# EAGLE design avr_core_1_1 (EAGLE 5.07)
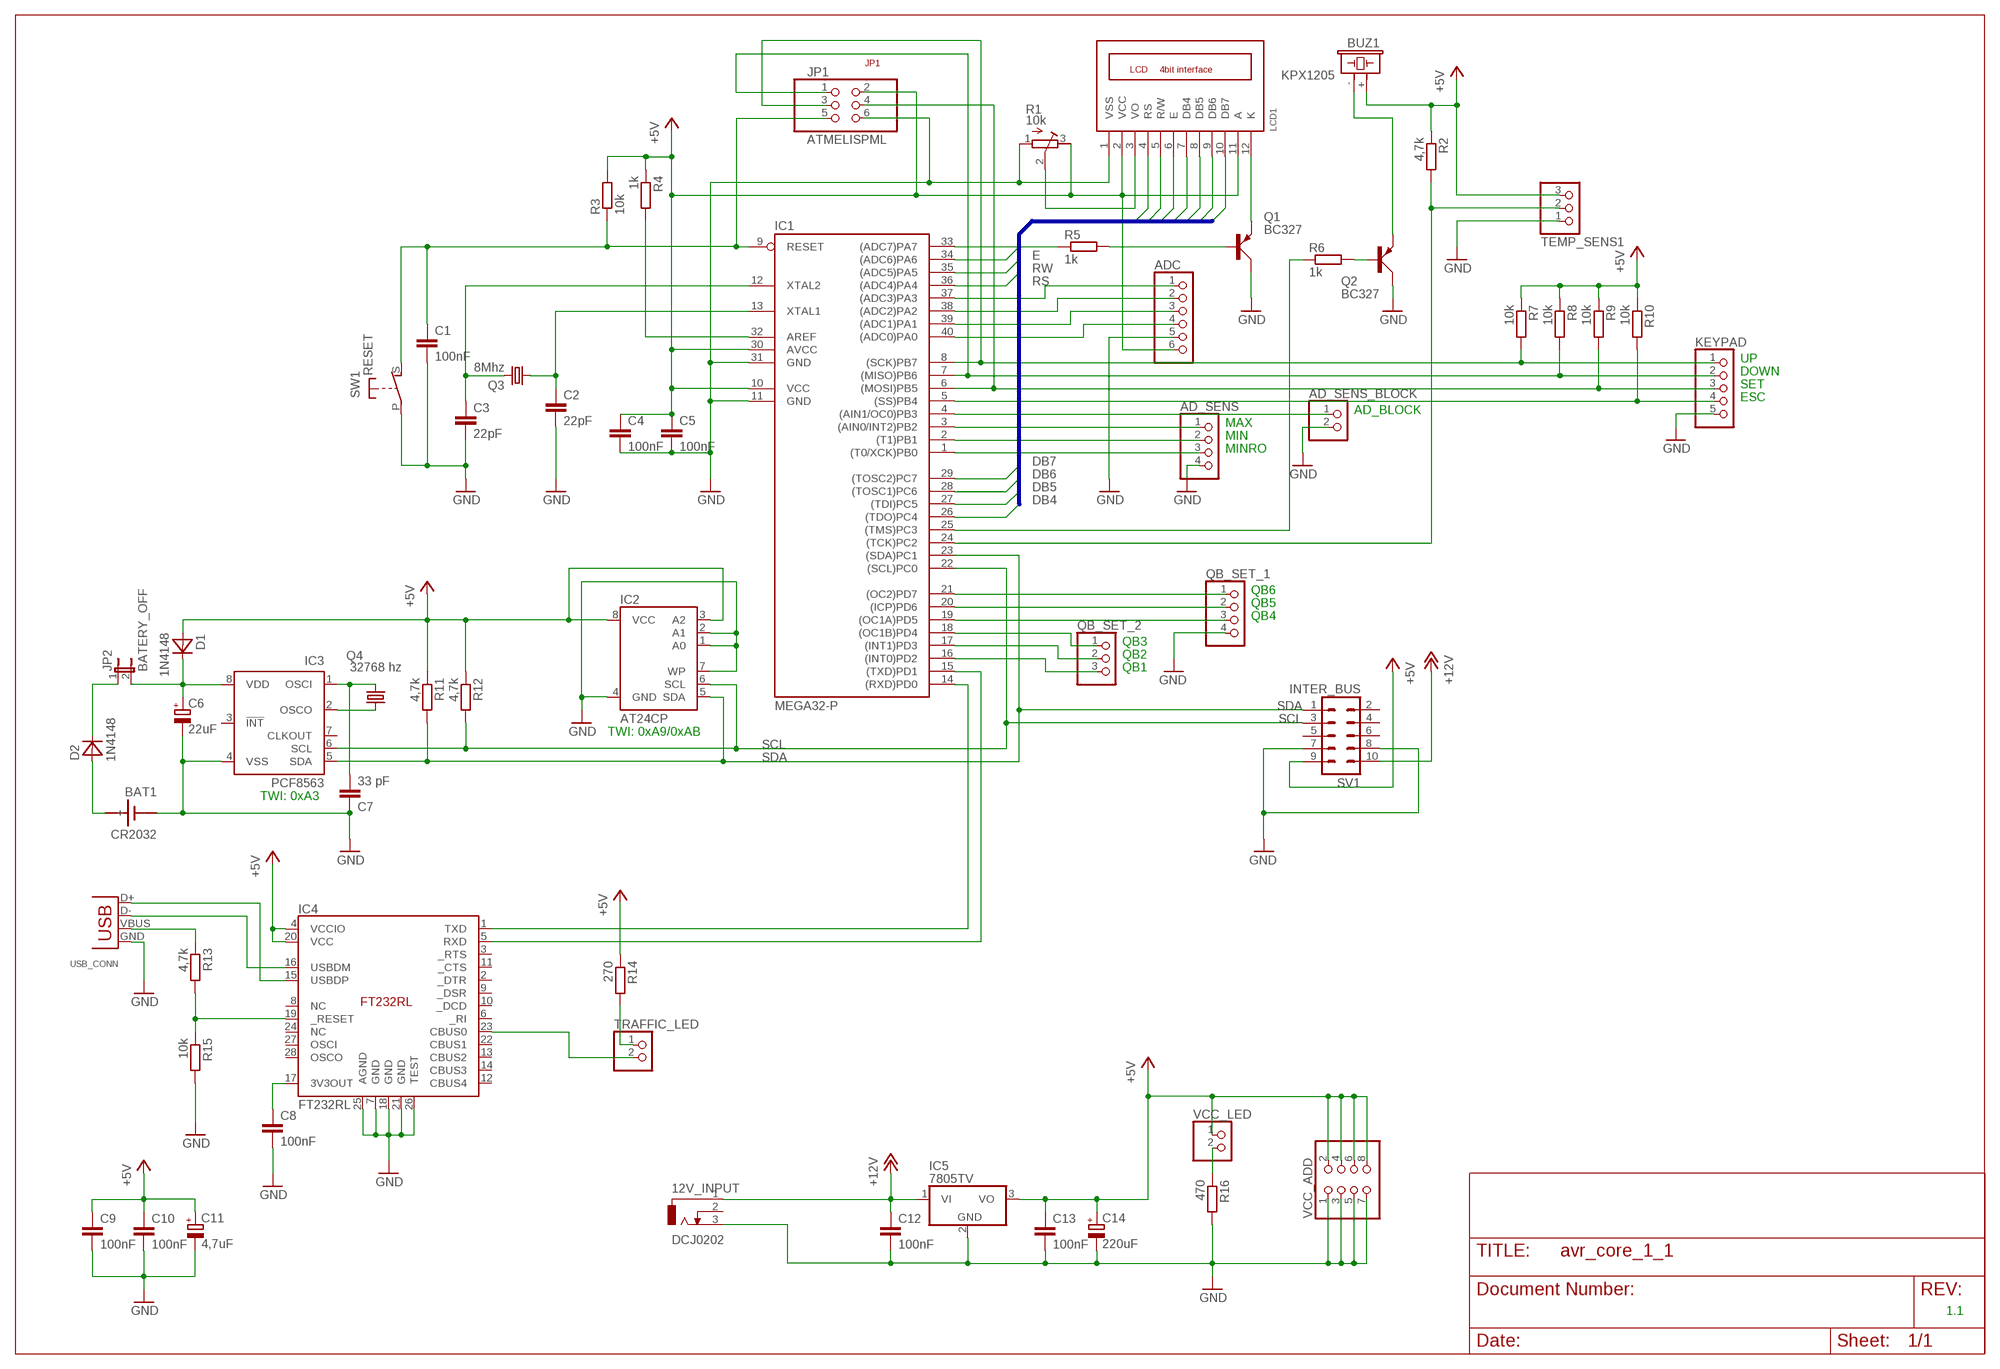
[diagram p0: schematic, sheet 1]

## Parts
12V_INPUT  DCJ0202  [DCJ0202]
AD_SENS  PINHD-1X4  [1X04]
AD_SENS_BLOCK  PINHD-1X2  [1X02]
ADC  PINHD-1X6  [1X06]
BAT1  CR2032  SN2032LISPOL  [SN2932_LISPOL]
BUZ1  KPX1205  [KPX1205]
C1  100nF  C-EU050-024X044  [C050-024X044]
C2  22pF  C-EU050-024X044  [C050-024X044]
C3  22pF  C-EU050-024X044  [C050-024X044]
C4  100nF  C-EUC1206  [C1206]
C5  100nF  C-EUC1206  [C1206]
C6  22uF  CPOL-EUE2.5-5  [E2,5-5]
C7  33 pF  C-EU050-024X044  [C050-024X044]
C8  100nF  C-EU050-024X044  [C050-024X044]
C9  100nF  C-EU050-024X044  [C050-024X044]
C10  100nF  C-EU050-024X044  [C050-024X044]
C11  4,7uF  CPOL-EUE2.5-5  [E2,5-5]
C12  100nF  C-EU050-024X044  [C050-024X044]
C13  100nF  C-EU050-024X044  [C050-024X044]
C14  220uF  CPOL-EUE2.5-5  [E2,5-5]
D1  1N4148  [DO35-7]
D2  1N4148  [DO35-7]
IC1  MEGA32-P  [DIL40]
IC2  AT24CP  [DIL08]
IC3  PCF8563  [DIL08]
IC4  FT232RL  [SSOP-28]
IC5  7805TV  [TO220V]
JP1  ATMELISPML  [ML6]
JP2  BATERY_OFF  JP1E  [JP1]
KEYPAD  PINHD-1X5  [1X05]
LCD1  LCD_4BITML14  [ML14]
Q1  BC327  [SOT54A]
Q2  BC327  [SOT54A]
Q3  8Mhz  CRYSTALHC49S  [HC49/S]
Q4  32768 hz  CRYSTALTC26V  [TC26V]
QB_SET_1  PINHD-1X4  [1X04]
QB_SET_2  PINHD-1X3  [1X03]
R1  10k  R-TRIMM  [R-TRIMM]
R2  4,7k  R-EU_0207/10  [0207/10]
R3  10k  R-EU_0207/10  [0207/10]
R4  1k  R-EU_0207/10  [0207/10]
R5  1k  R-EU_0207/10  [0207/10]
R6  1k  R-EU_0207/10  [0207/10]
R7  10k  R-EU_0207/10  [0207/10]
R8  10k  R-EU_0207/10  [0207/10]
R9  10k  R-EU_0207/10  [0207/10]
R10  10k  R-EU_0207/10  [0207/10]
R11  4,7k  R-EU_0207/10  [0207/10]
R12  4,7k  R-EU_0207/10  [0207/10]
R13  4,7k  R-EU_0207/10  [0207/10]
R14  270  R-EU_0207/10  [0207/10]
R15  10k  R-EU_0207/10  [0207/10]
R16  470  R-EU_0207/10  [0207/10]
SV1  INTER_BUS  ML10L  [ML10L]
SW1  RESET  [MICRO_SWITCH_3X6]
TEMP_SENS1  PINHD-1X3  [1X03]
TRAFFIC_LED  PINHD-1X2  [1X02]
USB_CONN  USB-B-H  [USB-B-H]
VCC_ADD  PINHD-2X4  [2X04]
VCC_LED  PINHD-1X2  [1X02]

## Nets
+5V [power]: ADC.6 BUZ1.+(PLUS) C4.1 C5.1 C9.1 C10.1 C11.+ C13.1 C14.+ D1.A IC1.10(VCC) IC1.30(AVCC) IC2.3(A2) IC2.8(VCC) IC4.4(VCCIO) IC4.20(VCC) IC5.3(VO) JP1.2(VCC) LCD1.2(VCC) LCD1.11(A) R1.3(A) R2.1 R3.2 R4.1 R7.1 R8.1 R9.1 R10.1 R11.1 R12.1 R14.1 SV1.9 TEMP_SENS1.3 VCC_ADD.2 VCC_ADD.4 VCC_ADD.6 VCC_ADD.8 VCC_LED.1
+12V: 12V_INPUT.1 C12.1 IC5.1(VI) SV1.10
DB4: IC1.26((TDO)PC4) LCD1.7(DB4)
DB5: IC1.27((TDI)PC5) LCD1.8(DB5)
DB6: IC1.28((TOSC1)PC6) LCD1.9(DB6)
DB7: IC1.29((TOSC2)PC7) LCD1.10(DB7)
E: IC1.34((ADC6)PA6) LCD1.6(E)
GND [power]: 12V_INPUT.3 AD_SENS.4 AD_SENS_BLOCK.2 ADC.5 BAT1.- C1.2 C2.2 C3.2 C4.2 C5.2 C6.- C7.1 C8.2 C9.2 C10.2 C11.- C12.2 C13.2 C14.- IC1.11(GND) IC1.31(GND) IC2.1(A0) IC2.2(A1) IC2.4(GND) IC2.7(WP) IC3.4(VSS) IC4.7(GND) IC4.18(GND) IC4.21(GND) IC4.25(AGND) IC4.26(TEST) IC5.2(GND) JP1.6(GND) KEYPAD.5 LCD1.1(VSS) Q1.C Q2.C QB_SET_1.4 R1.1(E) R15.2 R16.2 SV1.7 SV1.8 SW1.P TEMP_SENS1.1 USB_CONN.GND VCC_ADD.1 VCC_ADD.3 VCC_ADD.5 VCC_ADD.7
N$1: LCD1.3(VO) R1.2(S)
N$2: LCD1.12(K) Q1.E
N$3: IC3.2(OSCO) Q4.1
N$4 [power]: C7.2 IC3.1(OSCI) Q4.2
N$5: IC1.25((TMS)PC3) R6.1
N$6: C6.+ D1.C IC3.8(VDD) JP2.2
N$7: IC1.33((ADC7)PA7) R5.1
N$8: D2.C JP2.1
N$9: BAT1.+ D2.A
N$10: IC1.14((RXD)PD0) IC4.1(TXD)
N$11: IC1.16((INT0)PD2) QB_SET_2.3
N$12: IC1.15((TXD)PD1) IC4.5(RXD)
N$13: R13.1 USB_CONN.VBUS
N$14: IC4.15(USBDP) USB_CONN.D+
N$15: IC4.16(USBDM) USB_CONN.D-
N$16: IC4.19(_RESET) R13.2 R15.1
N$17: C3.1 IC1.12(XTAL2) Q3.2
N$18: C2.1 IC1.13(XTAL1) Q3.1
N$19: IC1.32(AREF) R4.2
N$20: C8.1 IC4.17(3V3OUT)
N$21: IC1.7((MISO)PB6) JP1.1(MISO) KEYPAD.2 R8.2
N$22: IC1.8((SCK)PB7) JP1.3(SCK) KEYPAD.1 R7.2
N$23: C1.1 IC1.9(RESET) JP1.5(RESET) R3.1 SW1.S(O)
N$24: IC1.6((MOSI)PB5) JP1.4(MOSI) KEYPAD.3 R9.2
N$25: IC1.17((INT1)PD3) QB_SET_2.2
N$26: IC1.18((OC1B)PD4) QB_SET_2.1
N$27: IC1.21((OC2)PD7) QB_SET_1.1
N$28: IC4.23(CBUS0) TRAFFIC_LED.2
N$29: R14.2 TRAFFIC_LED.1
N$30: Q1.B R5.2
N$31: IC1.20((ICP)PD6) QB_SET_1.2
N$32: IC1.19((OC1A)PD5) QB_SET_1.3
N$33: R16.1 VCC_LED.2
N$34: AD_SENS_BLOCK.1 IC1.4((AIN1/OC0)PB3)
N$35: AD_SENS.1 IC1.3((AIN0/INT2)PB2)
N$36: AD_SENS.2 IC1.2((T1)PB1)
N$37: AD_SENS.3 IC1.1((T0/XCK)PB0)
N$38: ADC.4 IC1.40((ADC0)PA0)
N$39: ADC.3 IC1.39((ADC1)PA1)
N$40: ADC.2 IC1.38((ADC2)PA2)
N$41: ADC.1 IC1.37((ADC3)PA3)
N$55: IC1.24((TCK)PC2) R2.2 TEMP_SENS1.2
N$65: IC1.5((SS)PB4) KEYPAD.4 R10.2
N$76: Q2.B R6.2
N$77: BUZ1.-(MINUS) Q2.E
RS: IC1.36((ADC4)PA4) LCD1.4(RS)
RW: IC1.35((ADC5)PA5) LCD1.5(R/W)
SCL: IC1.22((SCL)PC0) IC2.6(SCL) IC3.6(SCL) R12.2 SV1.3
SDA: IC1.23((SDA)PC1) IC2.5(SDA) IC3.5(SDA) R11.2 SV1.1
Unconnected: 12V_INPUT.2 IC3.3(!INT) IC3.7(CLKOUT) IC4.2(_DTR) IC4.3(_RTS) IC4.6(_RI) IC4.8(NC) IC4.9(_DSR) IC4.10(_DCD) IC4.11(_CTS) IC4.12(CBUS4) IC4.13(CBUS2) IC4.14(CBUS3) IC4.22(CBUS1) IC4.24(NC) IC4.27(OSCI) IC4.28(OSCO) SV1.2 SV1.4 SV1.5 SV1.6

## Buses
RS,RW,E,DB[4..7]

## Notes on the sheet
- UP
- DOWN
- SET
- ESC
- AD_BLOCK
- MAX
- MIN
- MINRO
- QB6
- QB5
- QB4
- QB3
- QB2
- QB1
- TWI: 0xA9/0xAB
- TWI: 0xA3
- 1.1

## Library data of the parts
12V_INPUT = con-jack:DCJ0202: DC POWER JACK Source: DCJ0202.pdf
AD_SENS QB_SET_1 = pinhead:PINHD-1X4: PIN HEADER
AD_SENS_BLOCK TRAFFIC_LED VCC_LED = pinhead:PINHD-1X2: PIN HEADER
ADC = pinhead:PINHD-1X6: PIN HEADER
BAT1 = sn2032:SN2032: LI BATTERY
BUZ1 = my_library:KPX1205: Buzzer with generator
C1-C5 C7-C10 C12 C13 = my_library:C-EU: CAPACITOR, European symbol
C6 C11 C14 = my_library:CPOL-EU: POLARIZED CAPACITOR, European symbol
D1 D2 = my_library:1N4148
IC1 = atmel:MEGA32-P: MICROCONTROLLER 32 Kbytes FLASH 2 Kbytes SRAM 1 Kbytes EEPROM USART 8-channel 10 bit ADC Source: www.atmel.com .. doc2503.pdf
IC2 = atmel:AT24C*: 2-wire serial EEPROM
IC3 = my_library:PCF8563: I2C-Bus CLOCK/CALENDAR
IC4 = ftdi4:FT232RL
IC5 = linear:78*: Positive VOLTAGE REGULATOR Source: http://cache.national.com/ds/LM/LM78L05.pdf http://www.fairchildsemi.com/ds/LM/LM7805.pdf
JP1 = my_library:ATMELISP
JP2 = jumper:JP1E: JUMPER
KEYPAD = pinhead:PINHD-1X5: PIN HEADER
LCD1 = my_library:LCD_4BIT
Q1 Q2 = my_library:BC327: PNP TRANSISTOR
Q3 Q4 = my_library:CRYSTAL: CRYSTAL
QB_SET_2 TEMP_SENS1 = pinhead:PINHD-1X3: PIN HEADER
R1 = my_library:R-TRIMM
R2-R16 = my_library:R-EU_: RESISTOR, European symbol
SV1 = my_library:ML10L: HARTING
SW1 = my_library:RESET
USB_CONN = con-usb-3:USB: USB Connectors
VCC_ADD = my_library:PINHD-2X4: PIN HEADER

## Board
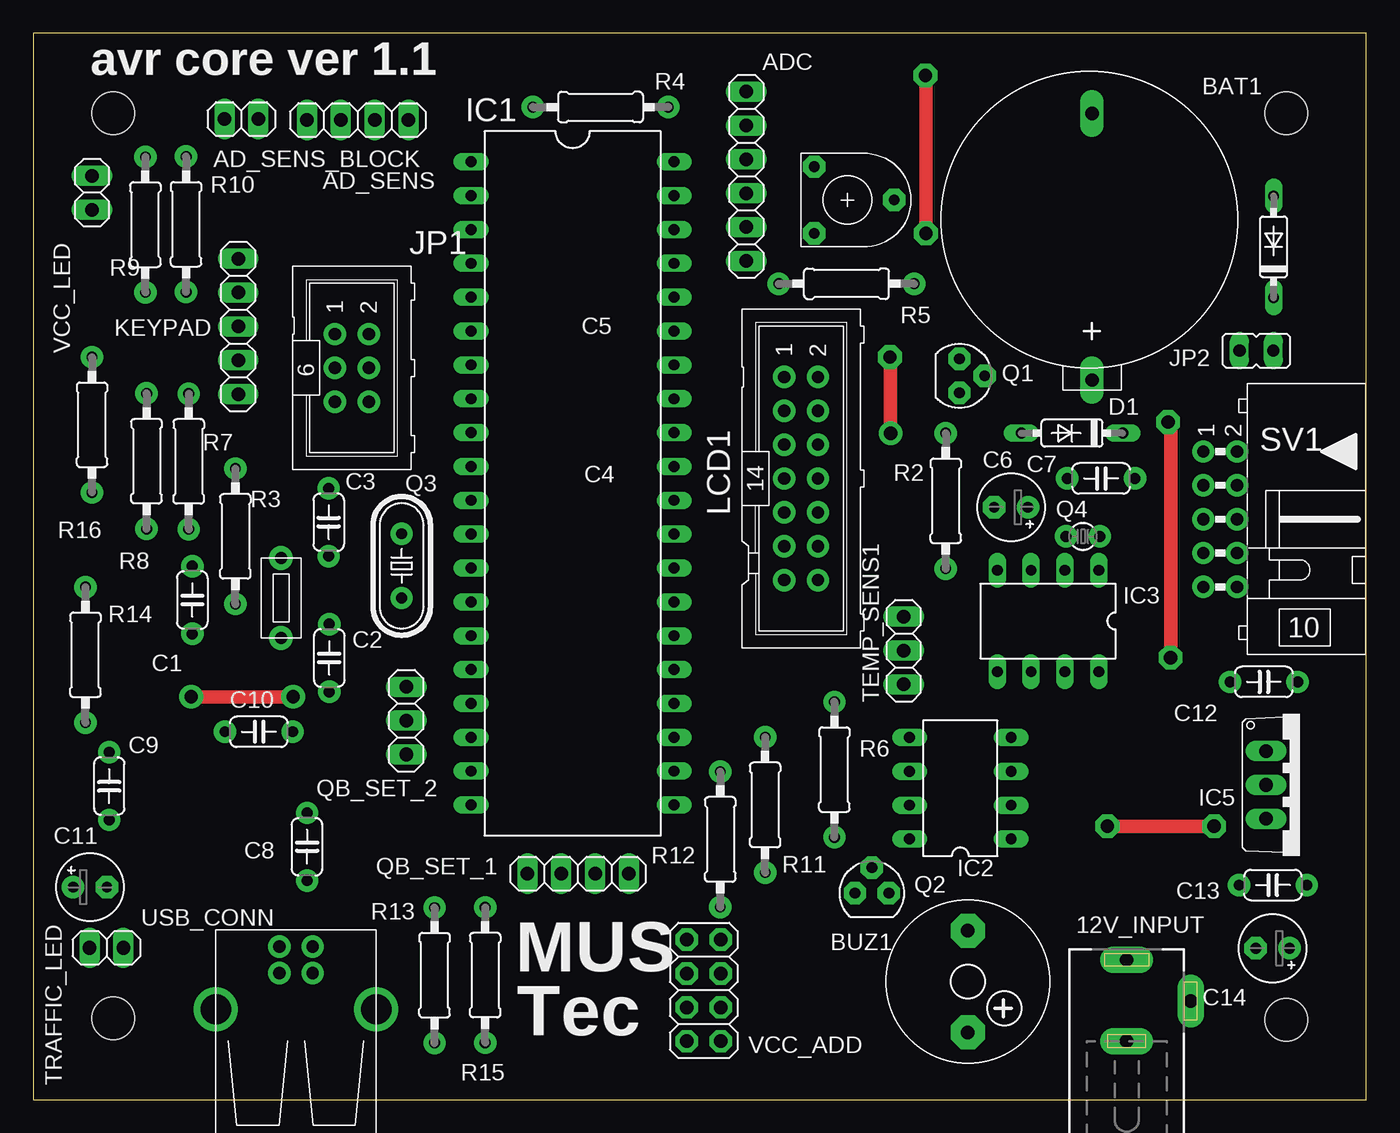
[diagram p1: board, top side]
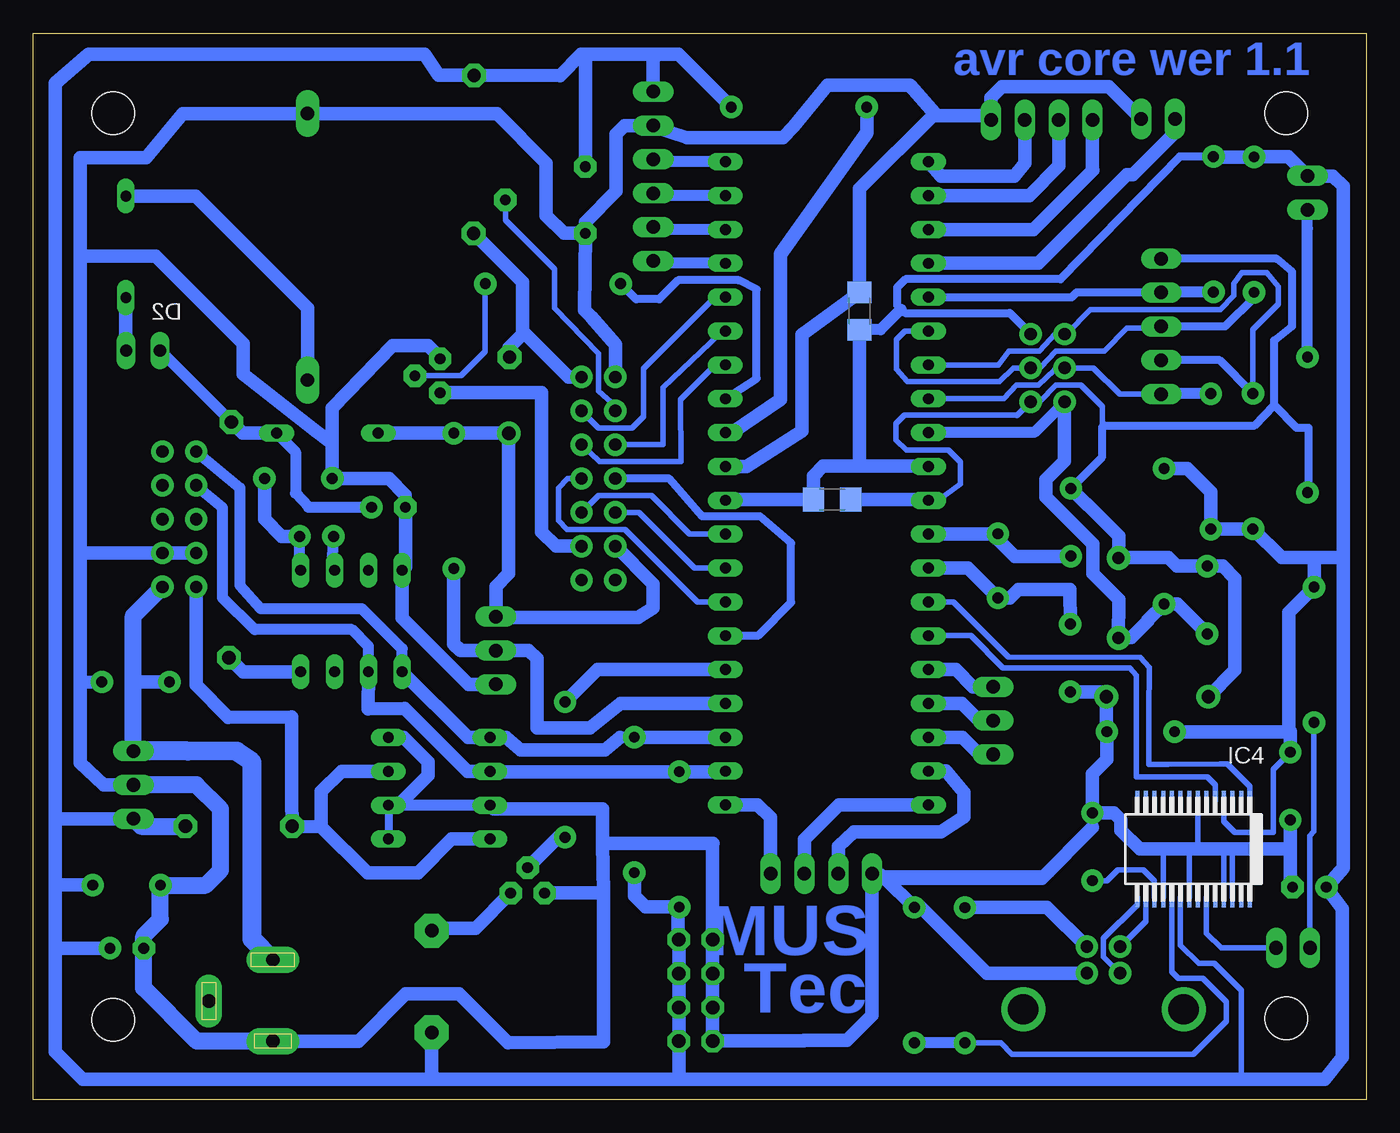
[diagram p2: board, bottom side, seen from below]

Size 100 x 80 mm. Coordinates in mm from the lower left corner, seen from the top.
Outline: 0,0 100,0 100,80 0,80 0,0
Copper layers (1*16): Top 0.035mm / dielectric 1.5mm / Bottom 0.035mm
Design rules "default": minimum track width 10mil, minimum drill 24mil, track to track 8mil, track to pad 8mil, pad to pad 8mil, via to via 8mil, smd to smd 8mil, copper to edge 40mil, drill to drill 8mil, minimum pad ring 10mil, minimum via ring 8mil, stop-mask expansion 4mil, vias tented up to drill 0mil, thermal gap 10mil
Holes 3.2 mm at 6,6.1 6,74 94,74 94,6

### Footprints (pad centres in the part's own frame; a part is rotated, then mirrored left to right if it is on the bottom)
DCJ0202 = drill 1 pad 2 long: 1 0,3.1; 2 4.8,0; 3 0,-3
1X04 = drill 1.016 long: 1 -3.81,0; 2 -1.27,0; 3 1.27,0; 4 3.81,0
1X02 = drill 1.016 long: 1 -1.27,0; 2 1.27,0
1X06 = drill 1.016 long: 1 -6.35,0; 2 -3.81,0; 3 -1.27,0; 4 1.27,0; 5 3.81,0; 6 6.35,0
SN2932_LISPOL = drill 1 pad 1.778 long: + 0,16.44; - 0,-3.56
KPX1205 = drill 1.016 pad 2.54 octagon: + 3.81,0; - -3.81,0
C050-024X044 = drill 0.813 pad 1.676 round: 1 -2.54,0; 2 2.54,0
C1206 = smd 1.6 x 1.8: 1 -1.4,0; 2 1.4,0
E2,5-5 = drill 0.813 pad 1.676 round: + -1.27,0 | drill 0.813 pad 1.676 octagon: - 1.27,0
DO35-7 = drill 0.813 long: A 5.08,0; C -2.54,0
DIL40 = drill 0.813 long: 1 -24.13,-7.62; 2 -21.59,-7.62; 3 -19.05,-7.62; 4 -16.51,-7.62; 5 -13.97,-7.62; 6 -11.43,-7.62; 7 -8.89,-7.62; 8 -6.35,-7.62; 9 -3.81,-7.62; 10 -1.27,-7.62; 11 1.27,-7.62; 12 3.81,-7.62; 13 6.35,-7.62; 14 8.89,-7.62; 15 11.43,-7.62; 16 13.97,-7.62; 17 16.51,-7.62; 18 19.05,-7.62; 19 21.59,-7.62; 20 24.13,-7.62; 21 24.13,7.62; 22 21.59,7.62; 23 19.05,7.62; 24 16.51,7.62; 25 13.97,7.62; 26 11.43,7.62; 27 8.89,7.62; 28 6.35,7.62; 29 3.81,7.62; 30 1.27,7.62; 31 -1.27,7.62; 32 -3.81,7.62; 33 -6.35,7.62; 34 -8.89,7.62; 35 -11.43,7.62; 36 -13.97,7.62; 37 -16.51,7.62; 38 -19.05,7.62; 39 -21.59,7.62; 40 -24.13,7.62
DIL08 = drill 0.813 long: 1 -3.81,-3.81; 2 -1.27,-3.81; 3 1.27,-3.81; 4 3.81,-3.81; 5 3.81,3.81; 6 1.27,3.81; 7 -1.27,3.81; 8 -3.81,3.81
SSOP-28 = smd 0.3 x 1.5: 1 -4.225,-3.625; 2 -3.575,-3.625; 3 -2.925,-3.625; 4 -2.275,-3.625; 5 -1.625,-3.625; 6 -0.975,-3.625; 7 -0.325,-3.625; 8 0.325,-3.625; 9 0.975,-3.625; 10 1.625,-3.625; 11 2.275,-3.625; 12 2.925,-3.625; 13 3.575,-3.625; 14 4.225,-3.625; 15 4.225,3.625; 16 3.575,3.625; 17 2.925,3.625; 18 2.275,3.625; 19 1.625,3.625; 20 0.975,3.625; 21 0.325,3.625; 22 -0.325,3.625; 23 -0.975,3.625; 24 -1.625,3.625; 25 -2.275,3.625; 26 -2.925,3.625; 27 -3.575,3.625; 28 -4.225,3.625
TO220V = drill 1.016 long: 1 -2.54,-2.54; 2 0,-2.54; 3 2.54,-2.54
ML6 = drill 0.914 pad 1.676 round: 1 -2.54,-1.27; 2 -2.54,1.27; 3 0,-1.27; 4 0,1.27; 5 2.54,-1.27; 6 2.54,1.27
JP1 = drill 0.914 long: 1 0,-1.27; 2 0,1.27
1X05 = drill 1.016 long: 1 -5.08,0; 2 -2.54,0; 3 0,0; 4 2.54,0; 5 5.08,0
ML14 = drill 0.914 pad 1.676 round: 1 -7.62,-1.27; 2 -7.62,1.27; 3 -5.08,-1.27; 4 -5.08,1.27; 5 -2.54,-1.27; 6 -2.54,1.27; 7 0,-1.27; 8 0,1.27; 9 2.54,-1.27; 10 2.54,1.27; 11 5.08,-1.27; 12 5.08,1.27; 13 7.62,-1.27; 14 7.62,1.27
SOT54A = drill 0.813 pad 1.676 octagon: B 0,1.905; C -1.27,0; E 1.27,0
HC49/S = drill 0.813 pad 1.676 round: 1 -2.413,0; 2 2.413,0
TC26V = drill 0.813 pad 1.676 round: 1 -1.27,0; 2 1.27,0
1X03 = drill 1.016 long: 1 -2.54,0; 2 0,0; 3 2.54,0
R-TRIMM = drill 0.8 pad 1.676 octagon: 1 -2,-2.5; 2 4,0; 3 -2,2.5
0207/10 = drill 0.813 pad 1.676 round: 1 -5.08,0; 2 5.08,0
ML10L = drill 0.914 pad 1.676 round: 1 -5.08,-1.27; 2 -5.08,1.27; 3 -2.54,-1.27; 4 -2.54,1.27; 5 0,-1.27; 6 0,1.27; 7 2.54,-1.27; 8 2.54,1.27; 9 5.08,-1.27; 10 5.08,1.27
MICRO_SWITCH_3X6 = drill 0.9 pad 1.778 round: P -2.96,-0.005; S 3.04,-0.005
USB-B-H = drill 0.914 pad 1.676 round: D+ 12.7,1.25; D- 14.681,1.25; GND 12.7,-1.25; VBUS 14.681,-1.25 | drill 2.286 round: P$1 9.982,-6.02; P$2 9.982,6.02
2X04 = drill 1.016 pad 1.676 octagon: 1 -3.81,-1.27; 2 -3.81,1.27; 3 -1.27,-1.27; 4 -1.27,1.27; 5 1.27,-1.27; 6 1.27,1.27; 7 3.81,-1.27; 8 3.81,1.27

### Placement (x,y rotation side)
12V_INPUT  82.03,7.39 0 top
AD_SENS  24.34,73.49 0 top
AD_SENS_BLOCK  15.61,73.57 0 top
ADC  53.5,69.27 90 top
BAT1  79.43,70.43 180 top
BUZ1  70.12,8.85 270 top
C1  11.93,37.48 90 top
C2  22.2,33.13 270 top
C3  22.16,43.32 90 top
C4  40.06,45 0 bottom
C5  38.01,59.16 90 bottom
C6  73.36,44.44 180 top
C7  80.11,46.6 0 top
C8  20.54,18.96 90 top
C9  5.69,23.52 270 top
C10  16.92,27.6 0 top
C11  4.25,15.93 0 top
C12  92.32,31.34 0 top
C13  93.01,16.09 180 top
C14  92.98,11.35 180 top
D1  79.2,50 180 top
D2  93.05,62.71 90 top
IC1  40.46,46.23 270 top
IC2  69.55,23.36 90 top
IC3  76.13,35.91 180 top
IC4  12.96,18.79 180 bottom
IC5  95.03,23.61 270 top
JP1  23.9,54.9 270 top
JP2  91.76,56.19 90 top
KEYPAD  15.37,58.01 90 top
LCD1  57.6,46.59 270 top
Q1  69.48,54.3 270 top
Q2  62.91,15.49 0 top
Q3  27.64,40.04 90 top
Q4  78.75,42.26 0 top
QB_SET_1  40.88,16.94 180 top
QB_SET_2  27.98,28.43 90 top
R1  60.58,67.49 0 top
R2  68.45,44.91 270 top
R3  15.16,42.26 90 top
R4  42.55,74.46 180 top
R5  61.01,61.21 0 top
R6  60.1,24.75 270 top
R7  11.66,47.88 90 top
R8  8.49,47.9 90 top
R9  8.41,65.64 270 top
R10  11.46,65.67 270 top
R11  54.91,22.1 90 top
R12  51.54,19.52 90 top
R13  30.1,9.33 270 top
R14  3.91,33.37 270 top
R15  33.9,9.34 90 top
R16  4.4,50.62 270 top
SV1  89.05,43.54 270 top
SW1  18.59,37.67 270 top
TEMP_SENS1  65.3,33.69 90 top
TRAFFIC_LED  5.49,11.38 0 top
USB_CONN  19.71,-3.21 90 top
VCC_ADD  50.3,8.18 270 top
VCC_LED  4.4,68.03 270 top

### Tracks (layer width: path | path; a pad name or v marks a point on that pad's centre or on a via)
+5V  (via drill 1 pad 1.78)
  Top 1.016: v88.6,20.5 v80.58,20.51 | v66.96,64.99 66.96,76.8 v66.93,76.84 | v64.27,55.7 64.31,55.66 64.31,50.01 v64.33,50
  Bottom 0.406: 13.93,14.23 IC4.20 13.93,11.59 12.56,10.21 11.41,10.21 9.38,8.18 9.38,1.75 9.15,1.53 | IC4.4 10.68,20.85 9.87,20.05 6.98,20.05 6.98,24.78 C9.1 | 48.04,45 IC1.30
  Bottom 0.61: R10.1 14,70.75 22.94,61.55 34.56,61.55 35.2,60.93 35.2,59.6 34.95,59.35 34.89,59.3 34.59,59.01 26.75,59.01 JP1.2
  Bottom 0.813: 11.43,70.72 R10.1 | R8.1 8.4,42.72 | R3.2 | 11.64,42.82 R7.1 | 6.34,40.68 6.35,40.67 | 3.61,40.68 3.91,40.38 | 5.82,27.64 5.85,27.6 | C9.1 5.82,26.18 | 51.63,14.34 R12.1 51.55,14.45 | R4.1 47.63,74.62 | 37.77,57.76 C5.1 | 34.89,59.3 36.44,57.76 37.77,57.76 | 37.77,57.76 38,57.53 | 32.85,47.51 IC1.10
  Bottom 1.016: 11.43,70.72 R9.1 8.39,70.74 5.84,70.74 VCC_LED.1 | R7.1 11.66,45.59 13.41,47.34 R3.2 | 6.35,40.67 R8.1 11.64,42.82 | 6.34,40.68 3.61,40.68 1.79,40.68 1.73,40.74 | 3.91,40.38 R14.1 5.82,36.54 5.82,27.64 5.69,27.64 C9.1 | 5.85,27.6 C10.1 | 51.39,1.53 9.15,1.53 3.12,1.53 1.78,3.19 1.78,14.29 C11.+ 1.73,17.38 1.73,40.74 | 51.39,1.53 69.73,1.53 | 69.73,1.53 96.31,1.53 98.35,3.58 98.35,11.32 | 98.35,11.32 98.35,15.93 | 98.35,15.93 98.35,20.86 | 98.35,20.86 98.35,76.24 95.83,78.42 70.66,78.42 69.6,76.84 v66.93,76.84 60.5,76.82 58.91,78.42 | R11.1 54.91,15.29 54.06,14.45 51.55,14.45 | BUZ1.+ 70.12,1.91 69.73,1.53 | 51.63,14.34 51.63,12.06 VCC_ADD.2 VCC_ADD.4 VCC_ADD.6 VCC_ADD.8 51.57,1.71 51.39,1.53 | 58.91,78.42 53.13,78.42 | 53.13,78.42 51.59,78.42 R4.1 | ADC.6 53.5,78.06 53.13,78.42 | R1.3 58.58,78.1 58.91,78.42 | LCD1.2 59.84,54.21 62.67,57.05 63.18,57.55 | 63.18,57.55 63.31,57.69 63.31,61.34 v66.96,64.99 | 38,57.53 38,48.97 38.03,48.95 38.03,47.62 38.14,47.51 | IC2.8 68.6,19.55 71.14,17.01 74.94,17.01 78.4,20.47 | 78.4,20.47 v80.58,20.51 80.62,22.64 80.62,28.7 85.37,28.68 87.79,31.11 SV1.9 | 78.4,20.47 78.4,23.12 76.89,24.63 IC2.3 | v64.27,55.7 | v64.27,55.7 64.31,55.66 64.31,56.41 63.18,57.55 | D1.A 74.11,50.01 68.47,50.01 R2.1 v64.33,49.99 v64.33,50 64.33,39.47 65.3,38.5 TEMP_SENS1.3 65.26,36.18 54.63,36.18 53.52,36.9 53.52,38.11 53.51,38.69 LCD1.11 | VCC_LED.1 4.36,69.34 | C13.1 98.2,16.09 98.35,15.93 | C14.+ 98.33,11.35 98.35,11.32 | IC5.3 98.14,21.07 98.35,20.86 | 48.04,45 C4.1 41.47,46.78 40.74,47.51 38.14,47.51 | 38.14,47.51 32.85,47.51 | 1.73,40.74 1.73,68.53 2.49,69.29 VCC_LED.1
  Bottom 1.27: v88.6,20.5 91.92,20.5 IC5.3
+12V
  Bottom 1.016: C12.1 92.45,31.34 92.49,31.29
  Bottom 1.27: IC5.1 92.49,31.29 92.49,36.29 SV1.10
  Bottom 1.422: 12V_INPUT.1 83.58,12.05 83.58,25.33 84.74,26.13 88.42,26.14 IC5.1
DB4
  Bottom 0.61: IC1.26 45.64,34.8 43.14,37.31 43.14,41.75 45.49,43.74 49.8,43.74 52.29,46.58 LCD1.7
DB5
  Bottom 0.406: IC1.27 50.18,37.34 55.62,42.78 59.94,42.78 60.6,43.44 60.6,45.9 59.92,46.58 58.88,46.58 LCD1.8
DB6
  Bottom 0.406: IC1.28 50.39,39.88 54.58,44.06 LCD1.9
  Bottom 0.61: LCD1.9
DB7
  Bottom 0.406: IC1.29 50.77,42.42 53.61,45.33 57.59,45.33 LCD1.10
E
  Bottom 0.406: IC1.34 48.84,55.12 51.44,52.52 51.4,47.87 55.06,47.88 57.5,47.88 LCD1.6
GND  (via drill 1 pad 1.78)
  Top 1.016: v19.5,30.22 v11.85,30.22
  Bottom 0.406: 19.81,50.45 19.81,52 21.4,53.61 23.27,53.62 24.49,52.37 JP1.6 26.19,51.33 26.2,51.34 34.66,51.34 35.29,50.72 35.29,49.5 34.51,48.72 31.33,48.72 30.45,47.83 30.45,46.17 32.14,44.96 IC1.11 32.88,45 | IC4.7 12.63,18.9 12.52,18.79 | IC4.21 13.28,18.78 13.29,18.79 | IC4.18 15.23,18.72 15.16,18.79 | IC4.26 10.03,18.64 9.88,18.79 | IC4.25 10.68,18.7 10.77,18.79
  Bottom 0.61: C3.2 19.81,48.21 19.81,50.45 19.68,50.58 8.36,50.58 6.91,52.09 | KEYPAD.5 6.71,63.09 5.56,62.11 5.56,58.03 6.91,56.95 6.91,52.09 | IC1.11 | IC2.2 IC2.1 | IC3.4 72.34,39.6 | 4.33,45.54 4.33,50.41 5.23,50.41 6.91,52.09 | QB_SET_1.4 23.67,16.94
  Bottom 0.813: 18.57,40.67 SW1.P | 20.92,44.63 20.94,44.63 | QB_SET_1.4 36.42,16.94 36.09,16.61 | R15.2 33.42,14.42 | 20.97,9.46 USB_CONN.GND | C8.2 20.54,20.41 | C8.2 | C8.2 20.56,21.52 | C11.- 5.69,16.11 | 5.69,18.79 | 27.56,16.61 27.63,16.68 | 32.37,73.98 32.22,73.83 | IC2.7 IC2.2 72.64,22.09 | 96.49,63.04 96.24,63.29 | IC3.4 72.1,39.72 | IC2.4 | 4.33,45.54 R16.2
  Bottom 1.016: 18.57,40.67 14.84,40.67 14.19,40.02 C1.2 10.76,40.02 9.84,39.1 9.84,32.22 v11.85,30.22 | SW1.P 18.57,42.28 20.92,44.63 | 20.94,44.63 C3.2 | QB_SET_1.4 | R15.2 36.09,16.61 27.56,16.61 24.34,16.61 20.54,20.41 | 33.42,14.42 28.45,9.46 20.97,9.46 | 57.28,19.2 49.02,19.22 49.03,19.22 VCC_ADD.1 VCC_ADD.3 VCC_ADD.5 VCC_ADD.7 49.03,4.42 42.2,4.42 42.18,4.43 38.95,4.43 37.07,6.31 QB_SET_1.4 | 57.28,19.2 57.22,15.51 | 57.22,15.51 57.22,4.32 64.38,4.27 68.06,7.95 72.09,7.95 75.61,4.35 81.99,4.35 12V_INPUT.3 | C8.2 18.93,21.51 18.42,21 18.42,20.21 17,18.79 15.16,18.79 13.29,18.79 12.52,18.79 10.77,18.79 9.88,18.79 5.69,18.79 | 20.56,21.52 20.56,24.43 19.45,25.54 C10.2 19.5,27.64 v19.5,30.22 19.87,30.59 C2.2 | 5.69,16.11 5.69,18.79 C9.2 | R1.1 58.58,65.85 56.28,68.15 56.28,72.45 55.64,73.08 ADC.5 53.49,73.07 53.49,72.99 50.97,72.17 43.75,72.16 42.98,72.99 40.41,76.1 34.22,76.09 32.37,73.98 38.01,68.34 C5.2 42.32,57.39 42.32,50.14 46.49,47.5 IC1.31 | R1.1 60.2,64.99 61.52,66.32 61.52,70.27 65.22,73.97 79.41,73.97 BAT1.- 79.44,73.97 88.78,73.97 91.53,70.67 96.49,70.67 96.49,63.04 96.49,41 | LCD1.1 56.33,56.66 58.17,58.73 58.66,59.24 R1.1 | IC2.4 73.93,27.17 | 57.22,15.51 Q2.C | 96.24,63.29 90.83,63.29 84.25,56.72 84.25,54.42 78.86,50.21 77.78,49.36 | 57.28,19.2 57.31,21.8 65.45,21.8 IC2.7 | 72.64,22.09 70.39,24.33 70.39,25.33 72.23,27.17 IC2.4 | C6.- 72.07,44.46 | C6.- 72.09,39.95 IC3.4 72.33,39.71 72.33,36.12 71.71,35.49 71.68,35.49 67.33,31.15 TEMP_SENS1.1 | 32.22,73.83 28.49,73.83 AD_SENS.4 28.16,73.5 28.16,75.18 27.34,76 19.32,76 AD_SENS_BLOCK.2 | SV1.7 SV1.8 96.49,41
  Bottom 1.016: IC5.2 94.72,23.6 96.48,25.27 96.49,31.21 | 96.49,31.21 96.49,40.31 96.49,41 | C12.2 96.39,31.31 96.49,31.21 | C6.- 72.1,45.37 73.32,46.59 C7.1 77.6,46.6 77.6,49.21 77.78,49.36 | 32.88,45 C4.2 | Q1.C 69.37,55.57 70.38,56.58 73.06,56.58 77.6,51.87 77.6,49.37 77.78,49.36
  Bottom 1.27: IC5.2 87.78,23.61 85.96,21.79 85.96,17.2 87.07,16.08 C13.2 90.47,13.53 91.71,12.28 C14.- 91.74,11.32 91.74,8.38 87.73,4.37 87.71,4.39 12V_INPUT.3
N$1
  Bottom 0.406: 56.33,52.01 57.61,53.16 57.61,55.95 60.89,59.37 60.89,62.3 64.58,65.99 R1.2
  Bottom 0.61: LCD1.3 56.33,52.01 | R1.2
N$2
  Bottom 1.016: LCD1.12 60.8,41.51 61.86,42.58 61.86,48.46 61.85,53.03 63.49,53.03 Q1.E
N$3
  Bottom 0.813: Q4.1 77.59,39.91 IC3.2
N$4
  Bottom 0.813: Q4.2 80.02,39.79 IC3.1
  Bottom 1.016: C7.2 82.65,43.54 81.37,42.26 Q4.2
N$5
  Bottom 1.016: IC1.25 57.68,32.26 R6.1
N$6  (via drill 1 pad 1.78)
  Top 1.016: v85.33,33.16 85.33,50.64 v85.14,50.84
  Bottom 0.813: v85.14,50.84 JP2.2 | C6.+ 76.03,44.44 76.63,44.45 79.35,44.45 80.33,45.49 80.33,48.59 D1.C
  Bottom 1.016: IC3.8 84.27,32.09 v85.33,33.16 | v85.14,50.84 84.85,50.55 | v85.14,50.84 85.33,50.64 | D1.C 84.3,50 v85.14,50.84
N$7
  Bottom 0.61: IC1.33 48.08,52.6 45.73,54.11 45.73,60.8 47.06,61.47 51.63,61.47 53.05,60.05 54.77,60.05 R5.1
N$8
  Bottom 1.016: D2.C 93.05,56.21 JP2.1
N$9
  Bottom 1.016: BAT1.+ 79.43,59.38 87.84,67.79 D2.A
N$10
  Bottom 0.406: IC4.1 8.73,23.49 10.41,25.17 10.94,25.17 14.88,25.14 16.32,25.14 16.29,27.23 16.29,29.04 16.26,32.4 16.93,33.16 26.83,33.2 30.98,37.34 IC1.14
N$11
  Bottom 0.813: IC1.16
  Bottom 1.016: QB_SET_2.3 29.5,30.97 30.8,32.27 IC1.16
N$12
  Bottom 0.406: IC1.15 32,34.8 31.99,34.81 29.67,34.81 27.26,32.4 17.73,32.36 17.25,31.81 17.23,24.19 11.92,24.19 11.33,23.6 IC4.5
N$13
  Bottom 1.016: R13.1 23.94,14.4 USB_CONN.VBUS
N$14
  Bottom 0.406: IC4.15 17.18,14.62 19.71,12.1 19.71,10.69 USB_CONN.D+
N$15
  Bottom 0.406: IC4.16 16.53,13.35 USB_CONN.D-
N$16
  Bottom 0.406: R13.2 27.42,4.25 26.58,3.4 12.96,3.4 10.48,5.88 10.48,7.34 12.25,9.11 14.11,9.11 14.59,9.6 14.59,15.15 IC4.19
  Bottom 0.813: R15.1 30.11,4.26 R13.2
N$17
  Bottom 0.813: 27.67,42.42 Q3.2 27.64,42.02 | C3.1 22.18,40.76
  Bottom 1.016: 27.67,42.42 IC1.12 | 27.64,42.02 26.37,40.76 22.18,40.76
N$18
  Bottom 1.016: IC1.13 29.89,39.88 Q3.1 26.74,37.63 26.1,38.26 22.21,38.26 C2.1
N$19
  Bottom 0.813: IC1.32 47.6,50.04
  Bottom 1.016: R4.2 37.47,72.54 43.93,63.45 43.93,52.53 47.6,50.04
N$20
  Bottom 0.406: C8.1 19.44,16.42 18.62,17.24 16.7,17.24 15.88,16.42 IC4.17
N$21
  Bottom 0.406: IC1.7 27.61,55.12 26.79,56.16 24.52,56.17 23.71,57.06 23.36,57.44 JP1.1 | 22.48,57.44 20.68,59.28 10.96,59.27 9.93,60.31 9.93,61.23 9.32,62.05 7.45,62.05 6.6,61.01 6.6,59.68 8.5,57.78 8.5,52.99
  Bottom 0.61: KEYPAD.2 10.98,55.47 R8.2
  Bottom 0.813: 22.48,57.44 JP1.1 | R8.2 8.5,52.99
N$22
  Bottom 0.406: IC1.8 27.16,52.58 26.23,53.61 24.59,53.62 23.4,54.73 23.23,54.9 JP1.3 20.47,54.9 18.49,52.92 KEYPAD.1
  Bottom 0.813: KEYPAD.1 15.34,52.96 R7.2
N$23
  Bottom 0.813: JP1.5 22.63,52.31 24.89,50.04 IC1.9 | 16.37,35.97 16.37,35.91
  Bottom 1.016: JP1.5 22.63,47.92 24.04,46.51 24.04,45.22 20.5,41.69 20.5,39.45 18.57,37.52 SW1.S 17.62,34.66 16.37,35.91 | 16.37,35.97 R3.1 14.17,37.18 C1.1
N$24
  Bottom 0.406: 15.5,57.88 17.96,57.88 19.65,56.16 23.29,56.16 24.44,54.91 JP1.4 26.48,54.9 27.5,53.86 34.4,53.87 35.23,54.8 35.23,57.02 34.59,57.66 IC1.6
  Bottom 0.61: R9.2 8.41,60.18 10.59,58 15.36,58 | IC1.6
  Bottom 0.813: 15.5,57.88 KEYPAD.3 15.36,58
N$25
  Bottom 0.813: IC1.17
  Bottom 1.016: QB_SET_2.2 29.07,28.43 30.35,29.71 IC1.17
N$26
  Bottom 0.813: QB_SET_2.1 29.02,25.89 | 32.81,27.15 IC1.18
  Bottom 1.016: 29.02,25.89 30.29,27.15 32.81,27.15
N$27
  Bottom 1.016: QB_SET_1.1 44.69,21.15 45.65,22.11 48.07,22.11 IC1.21
N$28
  Bottom 0.406: IC4.23 11.98,12.47 10.88,11.36 7.8,11.36 TRAFFIC_LED.2
N$29
  Bottom 0.406: TRAFFIC_LED.1 4.25,19.8 3.91,20.1 R14.2
  Bottom 0.61: R14.2
  Bottom 0.813: R14.2 3.89,28.27
N$30
  Bottom 0.406: Q1.B 67.91,54.3 66.1,56.11 66.1,61.2
  Bottom 0.61: 66.1,61.2 R5.2
N$31
  Bottom 0.813: IC1.20 32.85,22.11
  Bottom 1.016: QB_SET_1.2 42.15,19.53 39.57,22.11 32.85,22.11
N$32
  Bottom 0.813: 32.83,24.65 IC1.19
  Bottom 1.016: QB_SET_1.3 39.61,18.98 38.43,20.09 31.91,20.09 30.18,21.21 30.18,23.03 31.52,24.65 32.83,24.65
N$33
  Bottom 0.813: R16.1 4.4,65.35 VCC_LED.2
N$34
  Bottom 1.016: IC1.4 32.83,62.75 24.6,62.75 17.97,69.38 17.49,69.38 14.34,72.53 AD_SENS_BLOCK.1
N$35
  Bottom 1.016: IC1.3 24.96,65.27 20.51,69.72 20.53,69.74 AD_SENS.1
N$36
  Bottom 1.016: IC1.2 32.83,67.83 25.28,67.83 23.05,70.06 23.07,70.08 AD_SENS.2
N$37
  Bottom 1.016: IC1.1 31.91,69.27 26.4,69.27 25.59,70.24 25.61,70.26 AD_SENS.3
N$38
  Bottom 0.813: IC1.40 53.32,70.36 ADC.4
N$39
  Bottom 0.813: IC1.39 53.32,67.82 ADC.3
N$40
  Bottom 0.813: IC1.38 53.32,65.28 ADC.2
N$41
  Bottom 0.813: IC1.37 53.32,62.74 ADC.1
N$55
  Bottom 1.016: IC1.24 55.94,29.72 58.23,27.88 62.22,27.88 62.22,30.75 62.22,32.12 62.22,33.09 62.83,33.69 TEMP_SENS1.2 67.94,33.69 68.45,34.2 R2.2
N$65
  Bottom 0.61: KEYPAD.4 21.74,60.55 22.11,60.18 32.82,60.18 IC1.5
  Bottom 0.813: IC1.5 | R10.2 15.33,60.59 KEYPAD.4
N$76
  Bottom 1.016: Q2.B 61.37,18.93 60.62,19.68 R6.2
N$77
  Bottom 1.016: Q2.E 66.82,12.84 69.51,12.85 BUZ1.-
RS
  Bottom 0.406: IC1.36 48.85,60.2 54.21,54.84 54.21,51.26 55.09,50.38 57.58,50.38 LCD1.4
RW
  Bottom 0.406: IC1.35 48.49,57.46 52.77,53.44 52.77,49.15 LCD1.5
SCL
  Bottom 0.61: 65.71,24.6 IC2.6
  Bottom 0.813: IC1.22 48.12,24.6 | 72.15,29.36 72.12,29.36 | IC3.6 74.84,34.01 76.1,35.26 83.39,35.26 85.8,37.65 85.8,41.49 85.81,42.04 85.81,44.41 SV1.3
  Bottom 1.016: 48.12,24.6 R12.2 65.71,24.6 | IC2.6 67.42,24.62 72.15,29.36 | 72.12,29.36 74.89,29.32 IC3.6
SDA
  Bottom 0.813: IC1.23 | IC3.5 72.32,33.82 75.35,36.81 82.92,36.81 82.92,36.86 84.49,38.57 84.49,42.47 84.49,42.86 84.49,45.89 SV1.1 | R11.2 55.96,27.18 | IC2.5
  Bottom 1.016: IC1.23 R11.2 | IC2.5 67.39,27.17 IC3.5 | 55.96,27.18 57.1,26.24 63.44,26.24 64.52,27.17 IC2.5
(copper drawn outside any net)
  shapes: Bottom circle x4

### Text on the board
Bottom: avr core wer 1.1 | MUS | Tec
tPlace: avr core ver 1.1 | MUS | Tec